# EAGLE design OLED-GYRO (EAGLE 9.6.2)
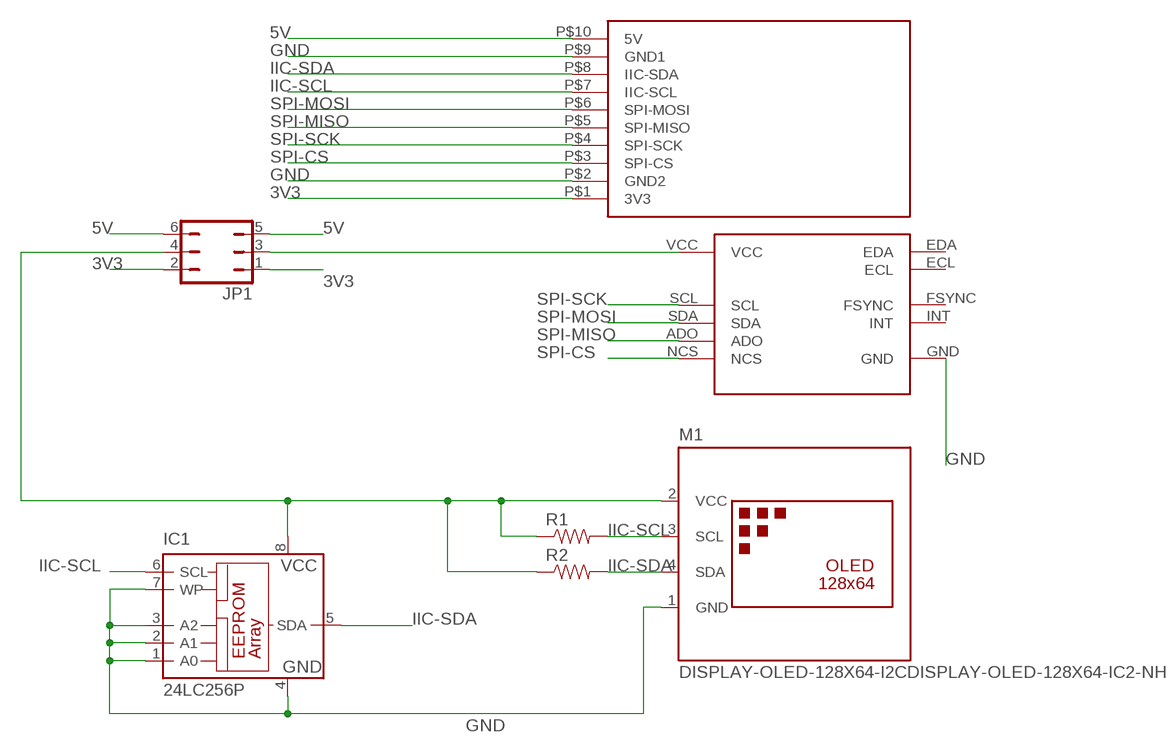
[diagram p0: schematic, sheet 1]

## Parts
IC1  24LC256P  [DIL8]
JP1  JP3Q  [JP3Q]
M1  DISPLAY-OLED-128X64-I2CDISPLAY-OLED-128X64-IC2-NH  [DISPLAY-OLED-128X64-I2C_NH]
R1  RESISTORPTH-1/4W  [AXIAL-0.4]
R2  RESISTORPTH-1/4W  [AXIAL-0.4]
U$1  E4_SPI-IIC  [E4_SPI-IIC]
U$2  MPU-9250/6500  [MPU9265]

## Nets
3V3: JP1.1 JP1.2 U$1.P$1(3V3)
5V: JP1.5 JP1.6 U$1.P$10(5V)
GND: IC1.1(A0) IC1.2(A1) IC1.3(A2) IC1.4(GND) IC1.7(WP) M1.1(GND) U$1.P$2(GND2) U$1.P$9(GND1) U$2.GND
IIC-SCL: IC1.6(SCL) M1.3(SCL) R1.P$2 U$1.P$7(IIC-SCL)
IIC-SDA: IC1.5(SDA) M1.4(SDA) R2.P$2 U$1.P$8(IIC-SDA)
N$1: JP1.3 U$2.VCC
N$3: IC1.8(VCC) JP1.4 M1.2(VCC) R1.P$1 R2.P$1
SPI-CS: U$1.P$3(SPI-CS) U$2.NCS
SPI-MISO: U$1.P$5(SPI-MISO) U$2.ADO
SPI-MOSI: U$1.P$6(SPI-MOSI) U$2.SDA
SPI-SCK: U$1.P$4(SPI-SCK) U$2.SCL
Unconnected: U$2.ECL U$2.EDA U$2.FSYNC U$2.INT

## Library data of the parts
IC1 = microchip:24*: Serial EEPROM I2C; MF: MICROCHIP; MPN: 24LC256-E/P; OC_FARNELL: 9757970; OC_NEWARK: 92C7169
JP1 = jumper:JP3Q: JUMPER
M1 = E4:DISPLAY-OLED-128X64-I2C: 128x64 Dot Matrix OLED Module based on SSD1306 chip Variant with I2C interface
R1 R2 = SparkFun:RESISTOR: Resistor Basic schematic elements and footprints for 0603, 1206, and PTH resistors.
U$1 = E4:E4_SPI-IIC
U$2 = E4:MPU-9250/6500

## Board
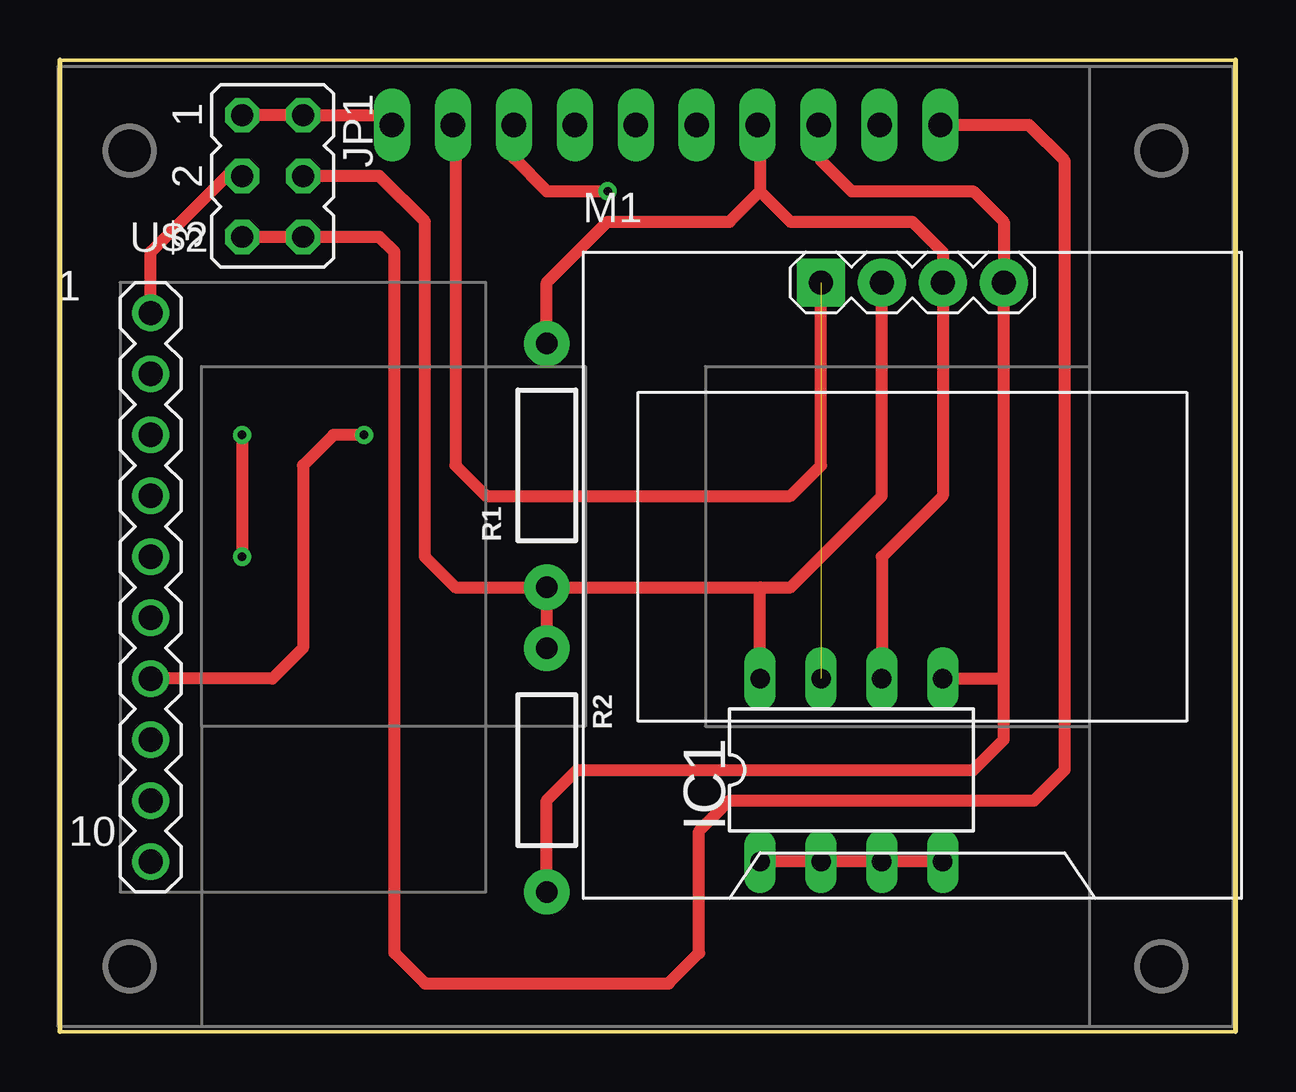
[diagram p1: board, top side]
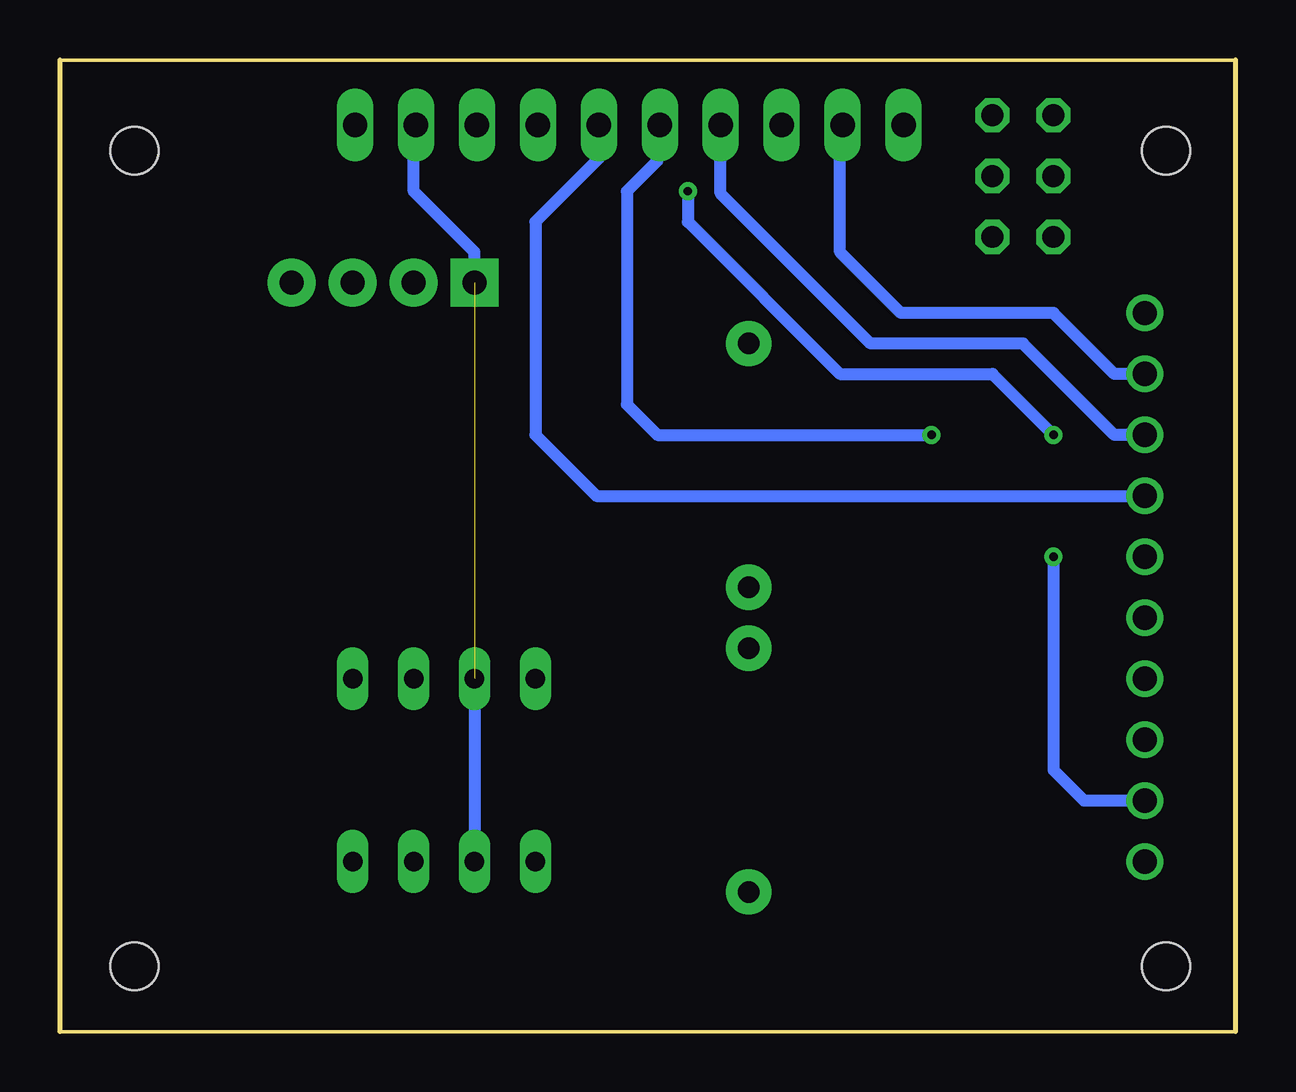
[diagram p2: board, bottom side, seen from below]

Size 49 x 40.5 mm. Coordinates in mm from the lower left corner, seen from the top.
Outline: 49,0 49,40.5 0,40.5 0,0 49,0
Copper layers (1*16): Top 0.035mm / dielectric 1.5mm / Bottom 0.035mm
Design rules "default": minimum track width 6mil, minimum drill 0.35mm, track to track 6mil, track to pad 6mil, pad to pad 6mil, via to via 6mil, smd to smd 6mil, copper to edge 40mil, drill to drill 6mil, minimum pad ring 10mil, minimum via ring 8mil, stop-mask expansion 4mil, vias tented up to drill 0mil, thermal gap 10mil

### Footprints (pad centres in the part's own frame; a part is rotated, then mirrored left to right if it is on the bottom)
DIL8 = drill 0.813 long: 1 -3.81,-3.81; 2 -1.27,-3.81; 3 1.27,-3.81; 4 3.81,-3.81; 5 3.81,3.81; 6 1.27,3.81; 7 -1.27,3.81; 8 -3.81,3.81
JP3Q = drill 0.914 octagon: 1 -2.54,-1.27; 2 -2.54,1.27; 3 0,-1.27; 4 0,1.27; 5 2.54,-1.27; 6 2.54,1.27
DISPLAY-OLED-128X64-I2C_NH = drill 1 pad 2 square: 1 -3.81,12.7 | drill 1 pad 2: 2 -1.27,12.7; 3 1.27,12.7; 4 3.81,12.7
AXIAL-0.4 = drill 0.9 pad 1.88: P$1 -5.08,0; P$2 5.08,0
E4_SPI-IIC = drill 1.016 long: P$1 -10.16,34.29; P$2 -7.62,34.29; P$3 -5.08,34.29; P$4 -2.54,34.29; P$5 0,34.29; P$6 2.54,34.29; P$7 5.08,34.29; P$8 7.62,34.29; P$9 10.16,34.29; P$10 12.7,34.29 | hole 2: -21.1,33.22; -21.1,-0.78; 21.9,33.22; 21.9,-0.78
MPU9265 = drill 1.016: ADO 3.81,0; ECL 1.27,0; EDA -1.27,0; FSYNC 11.43,0; GND -8.89,0; INT 6.35,0; NCS 8.89,0; SCL -6.35,0; SDA -3.81,0; VCC -11.43,0

### Placement (x,y rotation side)
IC1  32.99,10.9 0 top
JP1  8.86,35.66 270 top
M1  35.53,18.52 0 top
R1  20.29,23.6 90 top
R2  20.29,10.9 270 top
U$1  24,3.5 0 top
U$2  3.78,18.52 270 top

### Tracks (layer width: path | path; a pad name or v marks a point on that pad's centre or on a via)
3V3
  Top 0.508: JP1.1 JP1.2 13.43,38.2 U$1.P$1
5V
  Top 0.508: JP1.5 JP1.6 13.3,33.12 13.94,32.49 13.94,3.28 15.21,2.01 25.37,2.01 26.64,3.28 26.64,8.36 27.91,9.63 40.61,9.63 41.88,10.9 41.88,36.3 40.39,37.79 U$1.P$10
GND  (1 unrouted)
  Top 0.508: U$1.P$2 16.48,37.69 16.48,23.6 17.75,22.33 30.45,22.33 31.72,23.6 M1.1 | IC1.4 IC1.3 IC1.2 IC1.1
  Bottom 0.508: M1.1 31.72,32.49 34.26,35.03 34.26,37.69 U$1.P$9 | U$2.GND 5.05,27.41 7.59,29.95 13.94,29.95 16.48,32.49 16.48,37.69 U$1.P$2 | IC1.7 IC1.2
IIC-SCL
  Top 0.508: 29.18,35.03 29.18,37.69 U$1.P$7 | 29.18,35.03 30.45,33.76 35.53,33.76 36.8,32.49 M1.3 36.8,22.33 34.26,19.79 IC1.6 | R1.P$2 20.29,31.22 22.83,33.76 27.91,33.76 29.18,35.03
IIC-SDA
  Top 0.508: U$1.P$8 31.72,37.69 31.72,36.3 32.99,35.03 38.07,35.03 39.34,33.76 M1.4 39.34,14.71 | R2.P$2 20.29,9.63 21.56,10.9 38.07,10.9 39.34,12.17 39.34,14.71 | IC1.5 39.34,14.71
N$1
  Top 0.508: U$2.VCC 3.78,32.49 6.95,35.66 JP1.3
N$3
  Top 0.508: R1.P$1 R2.P$1 | R1.P$1 29.18,18.52 | 29.18,18.52 30.45,18.52 34.26,22.33 M1.2 | R1.P$1 16.48,18.52 15.21,19.79 15.21,33.76 13.3,35.66 JP1.4 | IC1.8 29.18,18.52
SPI-CS  (via drill 0.35)
  Top 0.508: U$1.P$3 18.92,36.4 20.29,35.03 v22.83,35.03 | v7.59,24.87 v7.59,19.79
  Bottom 0.508: v22.83,35.03 22.83,33.76 16.48,27.41 10.13,27.41 v7.59,24.87 | v7.59,19.79 7.59,10.9 6.32,9.63 U$2.NCS
SPI-MISO  (via drill 0.35)
  Top 0.508: v12.67,24.87 11.4,24.87 10.13,23.6 10.13,15.98 8.86,14.71 U$2.ADO
  Bottom 0.508: U$1.P$5 24.1,37.69 24.1,36.3 25.37,35.03 25.37,26.14 24.1,24.87 v12.67,24.87
SPI-MOSI
  Bottom 0.508: U$1.P$6 26.54,36.4 29.18,33.76 29.18,24.87 26.64,22.33 U$2.SDA
SPI-SCK
  Bottom 0.508: U$2.SCL 5.05,24.87 8.86,28.68 15.21,28.68 21.46,34.93 U$1.P$4